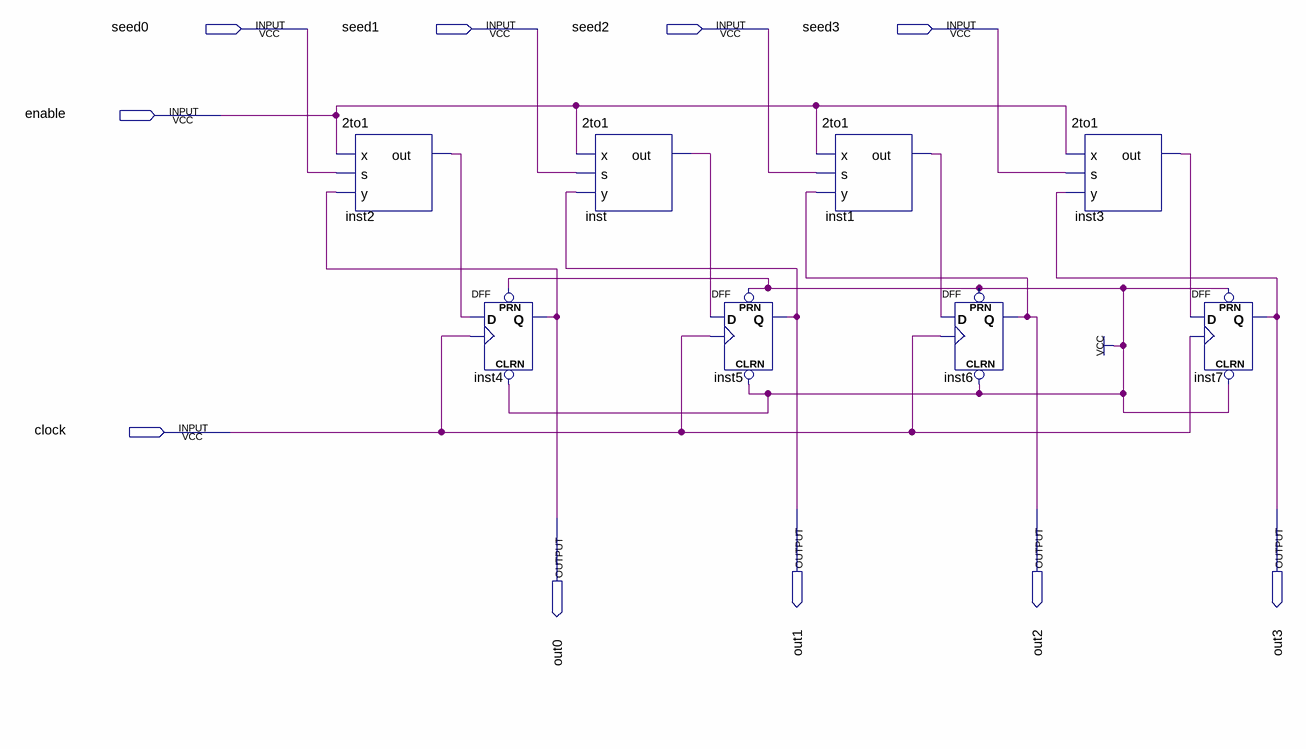
[diagram p0: schematic sheet]
// Quartus schematic 4bitreg.bdf as structural Verilog: 8 symbols, 10 pins
module \4bitreg  (
  input  seed0,
  input  seed1,
  input  seed2,
  input  seed3,
  input  enable,
  input  clock,
  output out1,
  output out2,
  output out3,
  output out0
);

  wire inst1_out, inst2_out, inst3_out, inst_out;

  \2to1  inst2 (.x(enable), .s(seed0), .y(out0), .out(inst2_out));
  DFF inst4 (.CLRN(1'b1), .CLK(clock), .D(inst2_out), .PRN(1'b1), .Q(out0));
  \2to1  inst (.x(enable), .s(seed1), .y(out1), .out(inst_out));
  DFF inst5 (.CLRN(1'b1), .CLK(clock), .D(inst_out), .PRN(1'b1), .Q(out1));
  \2to1  inst1 (.x(enable), .s(seed2), .y(out2), .out(inst1_out));
  DFF inst6 (.CLRN(1'b1), .CLK(clock), .D(inst1_out), .PRN(1'b1), .Q(out2));
  \2to1  inst3 (.x(enable), .s(seed3), .y(out3), .out(inst3_out));
  DFF inst7 (.CLRN(1'b1), .CLK(clock), .D(inst3_out), .PRN(1'b1), .Q(out3));
endmodule
